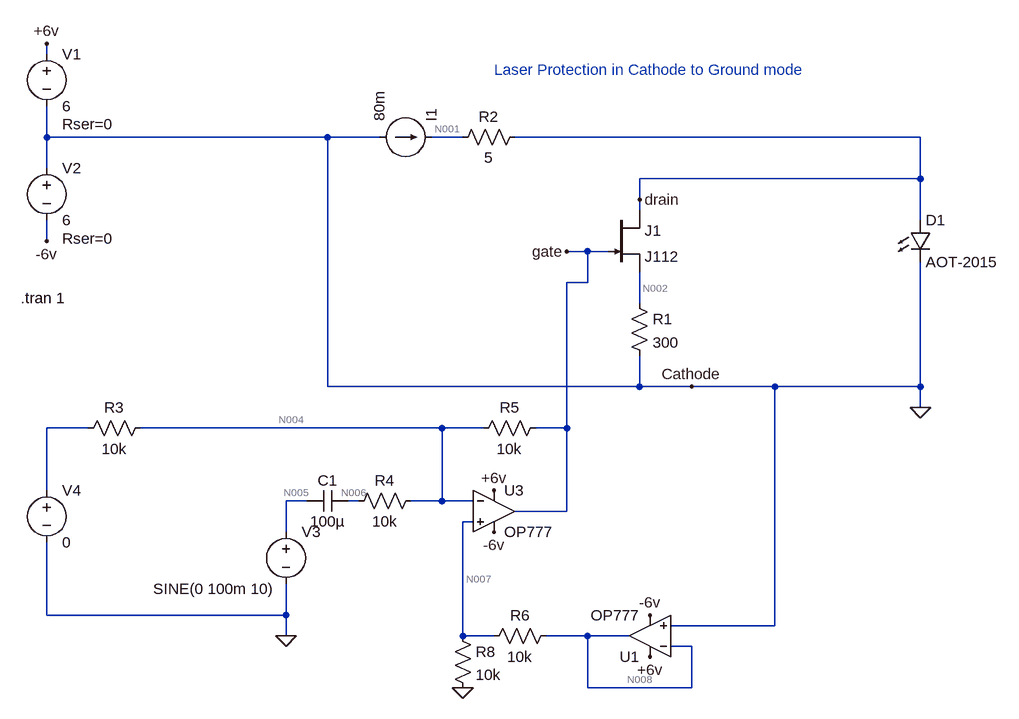
[diagram p0: schematic ModulationCathodeGrounded_Sinus.asc]
ModulationCathodeGrounded_Sinus.asc, the LTspice schematic file:
Version 4
SHEET 1 1528 1276
WIRE -48 176 -48 160
WIRE -48 304 -48 256
WIRE 384 304 -48 304
WIRE 464 304 384 304
WIRE 592 304 544 304
WIRE 1296 304 672 304
WIRE -48 352 -48 304
WIRE 1296 368 1296 304
WIRE 1296 368 864 368
WIRE 864 400 864 368
WIRE 864 416 864 400
WIRE 1296 432 1296 368
WIRE -48 464 -48 432
WIRE 784 480 752 480
WIRE 816 480 784 480
WIRE 784 528 784 480
WIRE 784 528 752 528
WIRE 864 560 864 512
WIRE 384 688 384 304
WIRE 864 688 864 640
WIRE 864 688 384 688
WIRE 944 688 864 688
WIRE 1072 688 944 688
WIRE 1296 688 1296 496
WIRE 1296 688 1072 688
WIRE 1296 720 1296 688
WIRE 16 752 -48 752
WIRE 560 752 96 752
WIRE 624 752 560 752
WIRE 752 752 752 528
WIRE 752 752 704 752
WIRE -48 848 -48 752
WIRE 352 864 320 864
WIRE 432 864 416 864
WIRE 560 864 560 752
WIRE 560 864 512 864
WIRE 608 864 560 864
WIRE 752 880 752 752
WIRE 752 880 672 880
WIRE 608 896 592 896
WIRE 320 912 320 864
WIRE -48 1040 -48 928
WIRE 320 1040 320 992
WIRE 320 1040 -48 1040
WIRE 1072 1056 1072 688
WIRE 1072 1056 912 1056
WIRE 320 1072 320 1040
WIRE 592 1072 592 896
WIRE 640 1072 592 1072
WIRE 784 1072 720 1072
WIRE 848 1072 784 1072
WIRE 944 1088 912 1088
WIRE 784 1152 784 1072
WIRE 944 1152 944 1088
WIRE 944 1152 784 1152
FLAG 864 400 drain
FLAG 752 480 gate
FLAG -48 160 +6v
FLAG -48 464 -6v
FLAG 640 848 +6v
FLAG 640 912 -6v
FLAG 944 688 Cathode
FLAG 592 1152 0
FLAG 880 1040 -6v
FLAG 880 1104 +6v
FLAG 320 1072 0
FLAG 1296 720 0
SYMBOL current 464 304 R270
WINDOW 0 24 80 Left 2
WINDOW 3 24 0 Left 2
WINDOW 123 0 0 Left 0
WINDOW 39 0 0 Left 0
SYMATTR InstName I1
SYMATTR Value 80m
SYMBOL res 688 288 R90
WINDOW 0 0 56 VBottom 2
WINDOW 3 32 56 VTop 2
SYMATTR InstName R2
SYMATTR Value 5
SYMBOL njf 816 416 R0
SYMATTR InstName J1
SYMATTR Value J112
SYMBOL res 848 544 R0
SYMATTR InstName R1
SYMATTR Value 300
SYMBOL LED 1280 432 R0
SYMATTR InstName D1
SYMATTR Value AOT-2015
SYMBOL OpAmps\\OP777 640 816 R0
SYMATTR InstName U3
SYMBOL voltage -48 160 R0
WINDOW 123 0 0 Left 0
WINDOW 39 24 124 Left 2
SYMATTR SpiceLine Rser=0
SYMATTR InstName V1
SYMATTR Value 6
SYMBOL voltage -48 336 R0
WINDOW 123 0 0 Left 0
WINDOW 39 24 124 Left 2
SYMATTR SpiceLine Rser=0
SYMATTR InstName V2
SYMATTR Value 6
SYMBOL res 528 848 R90
WINDOW 0 0 56 VBottom 2
WINDOW 3 32 56 VTop 2
SYMATTR InstName R4
SYMATTR Value 10k
SYMBOL res 720 736 R90
WINDOW 0 0 56 VBottom 2
WINDOW 3 32 56 VTop 2
SYMATTR InstName R5
SYMATTR Value 10k
SYMBOL OpAmps\\OP777 880 1136 R180
SYMATTR InstName U1
SYMBOL res 736 1056 R90
WINDOW 0 0 56 VBottom 2
WINDOW 3 32 56 VTop 2
SYMATTR InstName R6
SYMATTR Value 10k
SYMBOL res 576 1056 R0
SYMATTR InstName R8
SYMATTR Value 10k
SYMBOL voltage 320 896 R0
WINDOW 3 -204 103 Left 2
WINDOW 123 0 0 Left 0
WINDOW 39 0 0 Left 0
SYMATTR Value SINE(0 100m 10)
SYMATTR InstName V3
SYMBOL cap 416 848 R90
WINDOW 0 0 32 VBottom 2
WINDOW 3 32 32 VTop 2
SYMATTR InstName C1
SYMATTR Value 100µ
SYMBOL res 112 736 R90
WINDOW 0 0 56 VBottom 2
WINDOW 3 32 56 VTop 2
SYMATTR InstName R3
SYMATTR Value 10k
SYMBOL voltage -48 832 R0
WINDOW 123 0 0 Left 0
WINDOW 39 0 0 Left 0
SYMATTR InstName V4
SYMATTR Value 0
TEXT -88 552 Left 2 !.tran 1
TEXT 640 200 Left 2 ;Laser Protection in Cathode to Ground mode

The netlist it stands for:
* ModulationCathodeGrounded_Sinus.asc
I1 0 N001 80m
R2 drain N001 5
J1 drain gate N002 J112
R1 N002 0 300
D1 drain 0 AOT-2015
XU3 N007 N004 +6v -6v gate OP777  ; pins In+ In- V+ V- OUT
V1 +6v 0 6 Rser=0
V2 0 -6v 6 Rser=0
R4 N004 N006 10k
R5 gate N004 10k
XU1 0 N008 +6v -6v N008 OP777  ; pins In+ In- V+ V- OUT
R6 N008 N007 10k
R8 N007 0 10k
V3 N005 0 SINE(0 100m 10)
C1 N006 N005 100µ
R3 N004 N003 10k
V4 N003 0 0
.model D D
.lib standard.dio
.model NJF NJF
.model PJF PJF
.lib standard.jft
.tran 1
* Laser Protection in Cathode to Ground mode
.lib ADI.lib
.backanno
.end

* Results of the author's LTspice run, read from the files saved beside the schematic
* Operating Point, zero values left out:
*   V(n001) = 3.485 V
*   V(drain) = 3.085 V
*   V(gate) = 260 µV
*   V(n002) = 1.219 V
*   V(n004) = 177.6 µV
*   V(-6v) = -6 V
*   V(+6v) = 6 V
*   V(n007) = 97.6 µV
*   V(n006) = 177.6 µV
*   V(n008) = 80 µV
*   I(D1) = 75.94 mA
*   I(I1) = 80 mA
*   Id(J1) = 4.062 mA
*   Ig(J1) = -10.99 pA
*   Is(J1) = -4.062 mA
*   I(R3) = 17.76 nA
*   I(R8) = 9.76 nA
*   I(R6) = -1.76 nA
*   I(R5) = 8.24 nA
*   I(R1) = 4.062 mA
*   I(R2) = -80 mA
*   I(V4) = 17.76 nA
*   I(V2) = -481.4 µA
*   I(V1) = -481.4 µA
*   Ix(u3:1) = -11.52 nA
*   Ix(u3:2) = -9.519 nA
*   Ix(u3:99) = 240.7 µA
*   Ix(u3:50) = -240.7 µA
*   Ix(u3:45) = -8.229 nA
*   Ix(u1:1) = -11.52 nA
*   Ix(u1:2) = -9.519 nA
*   Ix(u1:99) = 240.7 µA
*   Ix(u1:50) = -240.7 µA
*   Ix(u1:45) = 11.28 nA
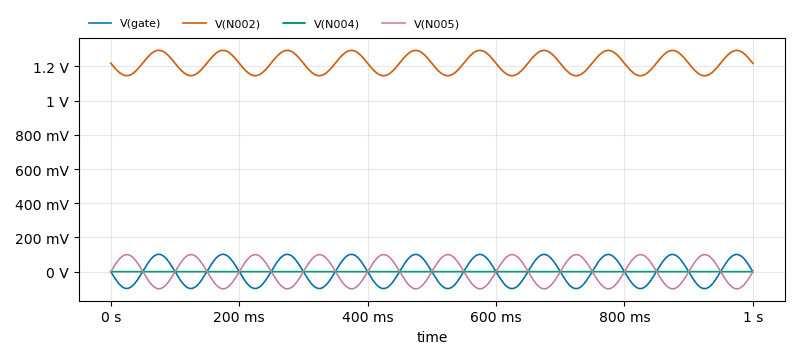
[diagram p1: Transient Analysis of ModulationCathodeGrounded_Sinus.asc, plotted from the saved traces]
* Transient Analysis, 1 run:
*   V(gate): min -98.96 mV, max 101.5 mV, average 1.265 mV, rms 70.64 mV, last -741 µV
*   V(N002): min 1.145 V, max 1.294 V, average 1.22 V, rms 1.221 V, last 1.218 V
*   V(N004): min 176.1 µV, max 179.6 µV, average 177.6 µV, rms 177.6 µV, last 179.1 µV
*   V(N005): min -100 mV, max 100 mV, average -25.94 nV, rms 70.73 mV, last 0 V